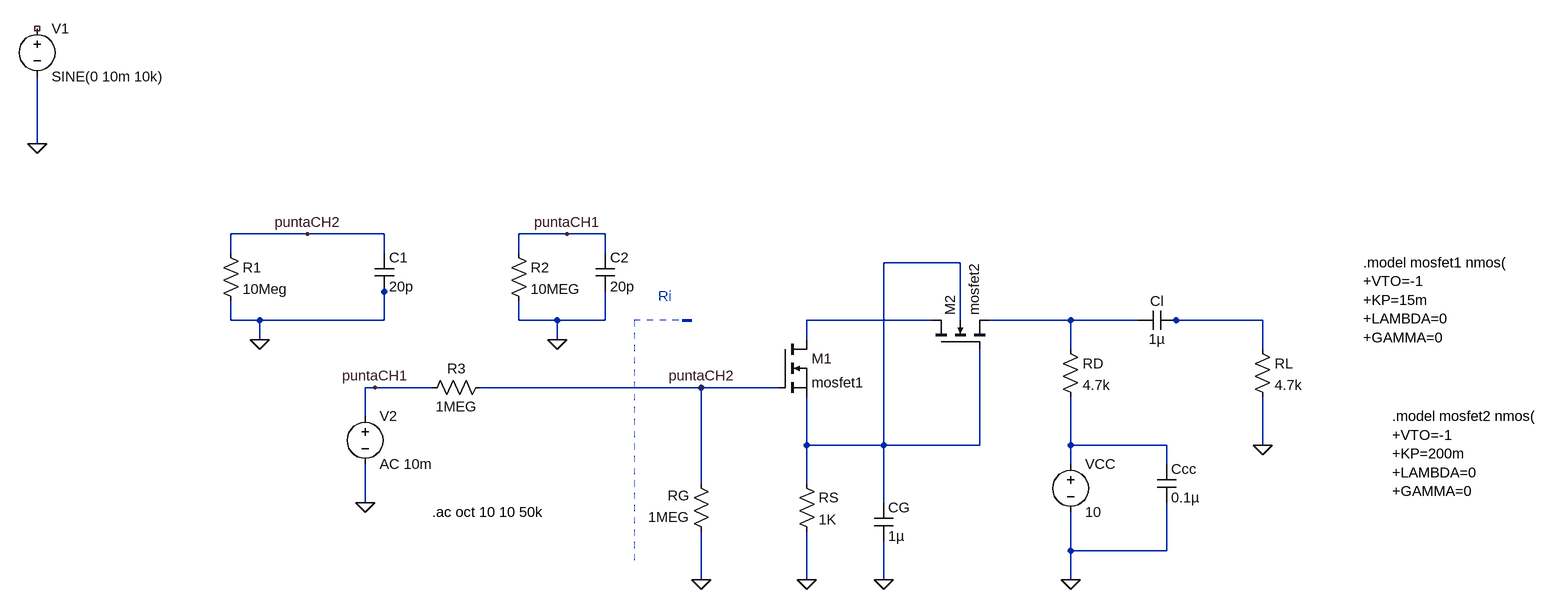
[diagram p0: schematic Ri.asc]
Ri.asc, the LTspice schematic file:
Version 4
SHEET 1 2100 680
WIRE -3440 -352 -3440 -464
WIRE -2336 -80 -2464 -80
WIRE -2208 -80 -2336 -80
WIRE -1904 -80 -1984 -80
WIRE -1840 -80 -1904 -80
WIRE -2464 -48 -2464 -80
WIRE -2208 -48 -2208 -80
WIRE -1984 -48 -1984 -80
WIRE -1840 -48 -1840 -80
WIRE -1248 -32 -1376 -32
WIRE -2208 16 -2208 0
WIRE -2464 64 -2464 32
WIRE -2416 64 -2464 64
WIRE -2208 64 -2208 16
WIRE -2208 64 -2416 64
WIRE -1984 64 -1984 32
WIRE -1920 64 -1984 64
WIRE -1840 64 -1840 16
WIRE -1840 64 -1920 64
WIRE -1296 64 -1504 64
WIRE -1248 64 -1248 -32
WIRE -1056 64 -1200 64
WIRE -944 64 -1056 64
WIRE -880 64 -896 64
WIRE -736 64 -880 64
WIRE -2416 96 -2416 64
WIRE -1920 96 -1920 64
WIRE -1504 96 -1504 64
WIRE -1056 112 -1056 64
WIRE -736 112 -736 64
WIRE -2224 176 -2240 176
WIRE -2128 176 -2224 176
WIRE -1680 176 -2048 176
WIRE -1552 176 -1680 176
WIRE -2240 224 -2240 176
WIRE -1504 272 -1504 192
WIRE -1376 272 -1376 -32
WIRE -1376 272 -1504 272
WIRE -1216 272 -1216 112
WIRE -1216 272 -1376 272
WIRE -1056 272 -1056 192
WIRE -896 272 -1056 272
WIRE -736 272 -736 192
WIRE -1056 304 -1056 272
WIRE -896 304 -896 272
WIRE -1680 336 -1680 176
WIRE -1504 336 -1504 272
WIRE -2240 368 -2240 304
WIRE -1376 368 -1376 272
WIRE -1056 448 -1056 384
WIRE -896 448 -896 368
WIRE -896 448 -1056 448
WIRE -1680 496 -1680 416
WIRE -1504 496 -1504 416
WIRE -1376 496 -1376 432
WIRE -1056 496 -1056 448
FLAG -1680 496 0
FLAG -1504 496 0
FLAG -1056 496 0
FLAG -1376 496 0
FLAG -736 272 0
FLAG -3440 -352 0
FLAG -2416 96 0
FLAG -1920 96 0
FLAG -2240 368 0
FLAG -1680 176 puntaCH2
FLAG -2224 176 puntaCH1
FLAG -1904 -80 puntaCH1
FLAG -2336 -80 puntaCH2
BUSTAP -1712 64 -1696 64
SYMBOL res -1664 432 R180
WINDOW 0 36 76 Left 2
WINDOW 3 36 40 Left 2
SYMATTR InstName RG
SYMATTR Value 1MEG
SYMBOL res -1520 320 R0
SYMATTR InstName RS
SYMATTR Value 1K
SYMBOL nmos4 -1296 112 R270
SYMATTR InstName M2
SYMATTR Value mosfet2
SYMBOL res -1072 96 R0
SYMATTR InstName RD
SYMATTR Value 4.7k
SYMBOL voltage -1056 288 R0
SYMATTR InstName VCC
SYMATTR Value 10
SYMBOL nmos -1552 96 R0
SYMATTR InstName M1
SYMATTR Value mosfet1
SYMBOL cap -1392 368 R0
SYMATTR InstName CG
SYMATTR Value 1µ
SYMBOL cap -912 304 R0
SYMATTR InstName Ccc
SYMATTR Value 0.1µ
SYMBOL cap -880 48 R90
WINDOW 0 0 32 VBottom 2
WINDOW 3 32 32 VTop 2
SYMATTR InstName Cl
SYMATTR Value 1µ
SYMBOL res -752 96 R0
SYMATTR InstName RL
SYMATTR Value 4.7k
SYMBOL voltage -3440 -560 R0
WINDOW 123 0 0 Left 2
WINDOW 39 0 0 Left 2
SYMATTR InstName V1
SYMATTR Value SINE(0 10m 10k)
SYMBOL res -2480 -64 R0
SYMATTR InstName R1
SYMATTR Value 10Meg
SYMBOL cap -2224 -48 R0
SYMATTR InstName C1
SYMATTR Value 20p
SYMBOL res -2000 -64 R0
SYMATTR InstName R2
SYMATTR Value 10MEG
SYMBOL cap -1856 -48 R0
SYMATTR InstName C2
SYMATTR Value 20p
SYMBOL voltage -2240 208 R0
WINDOW 123 0 0 Left 2
WINDOW 39 0 0 Left 2
SYMATTR InstName V2
SYMATTR Value AC 10m
SYMBOL res -2032 160 R90
WINDOW 0 0 56 VBottom 2
WINDOW 3 32 56 VTop 2
SYMATTR InstName R3
SYMATTR Value 1MEG
TEXT 72 -32 Left 2 !.model mosfet1 nmos( \n+VTO=-1 \n+KP=15m \n+LAMBDA=0 \n+GAMMA=0
TEXT 120 224 Left 2 !.model mosfet2 nmos( \n+VTO=-1 \n+KP=200m \n+LAMBDA=0 \n+GAMMA=0
TEXT -2128 384 Left 2 !.ac oct 10 10 50k
TEXT -1752 24 Left 2 ;Ri
LINE Normal -1792 64 -1792 464 2
LINE Normal -1696 64 -1792 64 2

The netlist it stands for:
* Ri.asc
RG 0 puntaCH2 1MEG
RS N001 0 1K
M2 N002 N001 N003 N001 mosfet2
RD N003 N005 4.7k
VCC N005 0 10
M1 N002 puntaCH2 N001 N001 mosfet1
CG N001 0 1µ
Ccc N005 0 0.1µ
Cl N004 N003 1µ
RL N004 0 4.7k
V1 NC_01 0 SINE(0 10m 10k)
R1 puntaCH2 0 10Meg
C1 puntaCH2 0 20p
R2 puntaCH1 0 10MEG
C2 puntaCH1 0 20p
V2 puntaCH1 0 AC 10m
R3 puntaCH2 puntaCH1 1MEG
.model NMOS NMOS
.model PMOS PMOS
.lib standard.mos
.model mosfet1 nmos(
+VTO=-1
+KP=15m
+LAMBDA=0
+GAMMA=0
.model mosfet2 nmos(
+VTO=-1
+KP=200m
+LAMBDA=0
+GAMMA=0
.ac oct 10 10 50k
* Ri
.backanno
.end